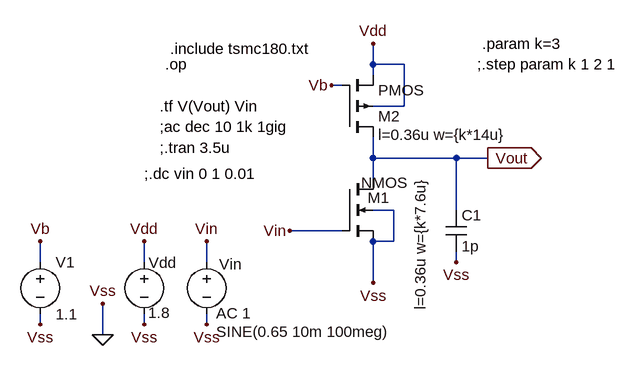
[diagram p0: schematic CS_amp with current source.asc]
CS_amp with current source.asc, the LTspice schematic file:
Version 4
SHEET 1 1056 680
WIRE 496 -96 496 -128
WIRE 544 -96 496 -96
WIRE 496 -80 496 -96
WIRE 448 -64 432 -64
WIRE 544 -32 544 -96
WIRE 544 -32 496 -32
WIRE 496 48 496 16
WIRE 624 48 496 48
WIRE 672 48 624 48
WIRE 496 80 496 48
WIRE 528 128 496 128
WIRE 624 128 624 48
WIRE 448 160 368 160
WIRE 528 176 528 128
WIRE 528 176 496 176
WIRE -16 208 -16 176
WIRE 144 208 144 176
WIRE 240 208 240 176
WIRE 624 208 624 192
WIRE 496 240 496 176
WIRE -16 304 -16 288
WIRE 144 304 144 288
WIRE 240 304 240 288
WIRE 80 320 80 272
FLAG 80 320 0
FLAG 80 272 Vss
FLAG 240 176 Vin
FLAG 144 304 Vss
FLAG 240 304 Vss
FLAG 144 176 Vdd
FLAG 496 -128 Vdd
FLAG 496 240 Vss
FLAG 672 48 Vout
IOPIN 672 48 Out
FLAG 624 208 Vss
FLAG 368 160 Vin
FLAG 432 -64 Vb
FLAG -16 304 Vss
FLAG -16 176 Vb
SYMBOL nmos4 448 80 R0
WINDOW 0 40 29 Left 2
WINDOW 3 30 6 Left 2
WINDOW 123 121 -2 VRight 2
SYMATTR InstName M1
SYMATTR Value2 l=0.36u w={k*7.6u}
SYMBOL voltage 144 192 R0
WINDOW 123 0 0 Left 0
WINDOW 39 0 0 Left 0
WINDOW 0 7 17 Left 2
WINDOW 3 6 94 Left 2
SYMATTR InstName Vdd
SYMATTR Value 1.8
SYMBOL voltage 240 192 R0
WINDOW 0 19 19 Left 2
WINDOW 3 15 123 Left 2
WINDOW 123 15 95 Left 2
WINDOW 39 0 0 Left 0
SYMATTR InstName Vin
SYMATTR Value SINE(0.65 10m 100meg)
SYMATTR Value2 AC 1
SYMBOL cap 608 128 R0
SYMATTR InstName C1
SYMATTR Value 1p
SYMBOL pmos4 448 16 M180
WINDOW 123 56 4 Left 2
SYMATTR Value2 l=0.36u w={k*14u}
SYMATTR InstName M2
SYMBOL voltage -16 192 R0
WINDOW 123 0 0 Left 0
WINDOW 39 0 0 Left 0
SYMATTR InstName V1
SYMATTR Value 1.1
TEXT 184 -120 Left 2 !.include tsmc180.txt
TEXT 176 -96 Left 2 !.op
TEXT 168 -32 Left 2 !.tf V(Vout) Vin
TEXT 168 0 Left 2 !;ac dec 10 1k 1gig
TEXT 168 32 Left 2 !;.tran 3.5u
TEXT 144 72 Left 2 !;.dc vin 0 1 0.01
TEXT 664 -128 Left 2 !.param k=3
TEXT 656 -96 Left 2 !;.step param k 1 2 1

The netlist it stands for:
* CS_amp with current source.asc
M1 Vout Vin 0 0 NMOS l=0.36u w={k*7.6u}
Vdd Vdd 0 1.8
Vin Vin 0 SINE(0.65 10m 100meg) AC 1
C1 Vout 0 1p
M2 Vout Vb Vdd Vdd PMOS l=0.36u w={k*14u}
V1 Vb 0 1.1
.model NMOS NMOS
.model PMOS PMOS
.lib standard.mos
.include tsmc180.txt
.op
.tf V(Vout) Vin
;ac dec 10 1k 1gig
;.tran 3.5u
;.dc vin 0 1 0.01
.param k=3
;.step param k 1 2 1
.backanno
.end